# Altium schematic sheet PCIe.SchDoc
size A4; SheetNumber: 3; SheetTotal: 15
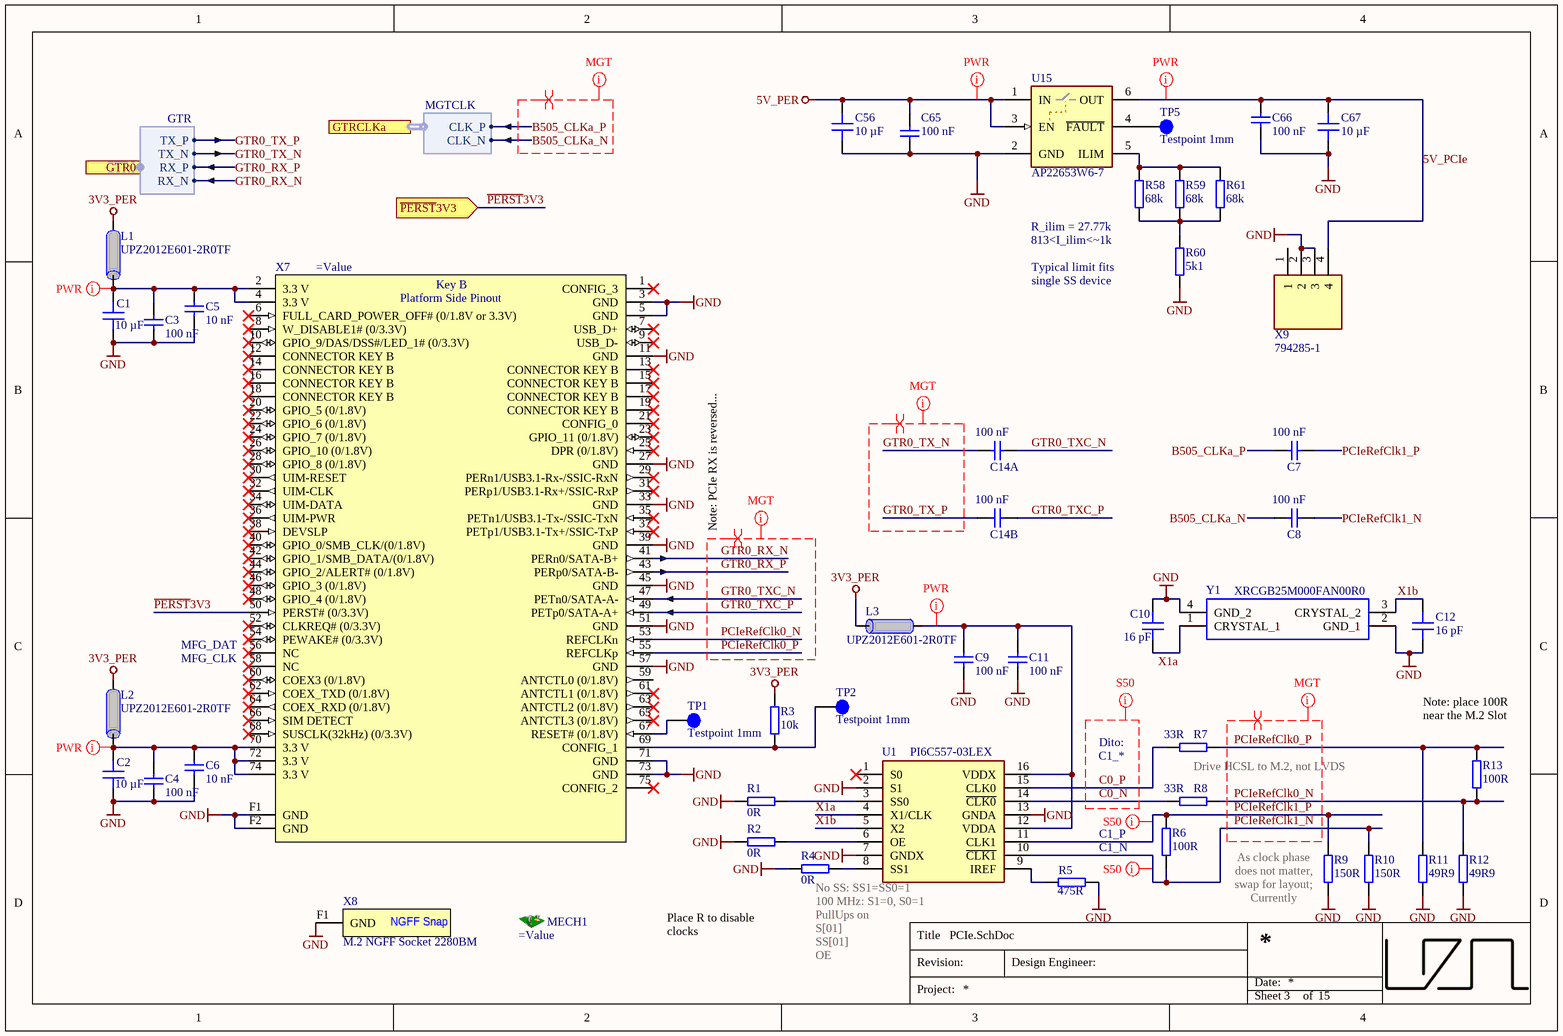
[diagram p0: PCIe.SchDoc]

## Parts
C1  10 µF  [C_0603_TE]
C2  10 µF  [C_0603_TE]
C3  100 nF  [C_0603_TE]
C4  100 nF  [C_0603_TE]
C5  10 nF  [C_0603_TE]
C6  10 nF  [C_0603_TE]
C7  100 nF  [C_0402_TE]
C8  100 nF  [C_0402_TE]
C9  100 nF  [C_0603_TE]
C10  16 pF  [C_0603_TE]
C11  100 nF  [C_0603_TE]
C12  16 pF  [C_0603_TE]
C14A  100 nF  [C_0402_TE]
C14B  100 nF  [C_0402_TE]
C56  10 µF  [C_0603_TE]
C65  100 nF  [C_0603_TE]
C66  100 nF  [C_0603_TE]
C67  10 µF  [C_0603_TE]
L1  UPZ2012E601-2R0TF  [INDC2012X92N_V]
L2  UPZ2012E601-2R0TF  [INDC2012X92N_V]
L3  UPZ2012E601-2R0TF  [INDC2012X92N_V]
MECH1  (no value)  [WA-SMSI-2.5mm]
R1  0R  [R_0603_TE]
R2  0R  [R_0603_TE]
R3  10k  [R_0603_TE]
R4  0R  [R_0603_TE]
R5  475R  [RES 0603_1608]
R6  100R  [R_0603_TE]
R7  33R  [R_0603_TE]
R8  33R  [R_0603_TE]
R9  150R  [R_0603_TE]
R10  150R  [R_0603_TE]
R11  49R9  [RES 0603_1608]
R12  49R9  [RES 0603_1608]
R13  100R  [R_0603_TE]
R58  68k  [R_0603_TE]
R59  68k  [R_0603_TE]
R60  5k1  [R_0603_TE]
R61  68k  [R_0603_TE]
TP1  Testpoint 1mm  [TP_1mm]  (no BOM)
TP2  Testpoint 1mm  [TP_1mm]  (no BOM)
TP5  Testpoint 1mm  [TP_1mm]  (no BOM)
U1  PI6C557-03LEX  [SOP65P640X120-16N]
U15  AP22653W6-7  [TSOT26-6]
X7  (no value)  [2199230-3]
X8  M.2 NGFF Socket 2280BM  [M.2-NGFF-Socket-2280BM]  (no BOM)
X9  794285-1  [7942851]
Y1  XRCGB25M000FAN00R0  [XRCGB25M000FAN00R0]

## Ports
GTR0 (harness GTR), GTRCLKa (harness MGTCLK), ~{PERST}3V3 (in)

## Harnesses
GTR: RX_N, RX_P, TX_N, TX_P
MGTCLK: CLK_N, CLK_P

## Nets
3V3_PER: L1.1 L2.1 L3.2 R3.2
5V_PER: C56.2 C65.1 U15.1(IN) U15.3(EN)
GND: C1.1 C2.1 C3.1 C4.1 C5.1 C6.1 C9.1 C10.1 C11.1 C12.2 C56.1 C65.2 C66.2 C67.1 R1.1 R2.1 R4.1 R5.1 R9.1 R10.1 R11.1 R12.1 R60.1 U1.2(S1) U1.7(GNDX) U1.13(GNDA) U15.2(GND) X7.3(GND) X7.5(GND) X7.11(GND) X7.27(GND) X7.33(GND) X7.39(GND) X7.45(GND) X7.51(GND) X7.57(GND) X7.71(GND) X7.73(GND) X7.F1(GND) X7.F2(GND) X8.F1(GND) X9.2 X9.3 Y1.2(GND_1) Y1.4(GND_2)
5V_PCIe: C66.1 C67.2 U15.6(OUT) X9.4
B505_CLKa_N: C8.1 ; port GTRCLKa.CLK_N
B505_CLKa_P: C7.1 ; port GTRCLKa.CLK_P
C0_N: R8.1 U1.14(~{CLK0})
C0_P: R7.1 U1.15(CLK0)
GTR0_RX_N: X7.41(PERn0/SATA-B+) ; port GTR0.RX_N
GTR0_RX_P: X7.43(PERp0/SATA-B-) ; port GTR0.RX_P
GTR0_TX_N: C14A.1 ; port GTR0.TX_N
GTR0_TX_P: C14B.1 ; port GTR0.TX_P
GTR0_TXC_N: C14A.2 X7.47(PETn0/SATA-A-)
GTR0_TXC_P: C14B.2 X7.49(PETp0/SATA-A+)
~{PERST}3V3: X7.50(PERST#_(0/3.3V)) ; port ~{PERST}3V3
PCIeRefClk0_N: R8.2 R12.2 R13.1 X7.53(REFCLKn)
PCIeRefClk0_P: R7.2 R11.2 R13.2 X7.55(REFCLKp)
PCIeRefClk1_N: C8.2 R6.1 R10.2 U1.10(~{CLK1})
PCIeRefClk1_P: C7.2 R6.2 R9.2 U1.11(CLK1)
X1a: C10.2 U1.4(X1/CLK) Y1.1(CRYSTAL_1)
X1b: C12.1 U1.5(X2) Y1.3(CRYSTAL_2)
NetC1_2: C1.2 C3.2 C5.2 L1.2 X7.2(3.3_V) X7.4(3.3_V)
NetC2_2: C2.2 C4.2 C6.2 L2.2 X7.70(3.3_V) X7.72(3.3_V) X7.74(3.3_V)
NetC9_2: C9.2 C11.2 L3.1 U1.12(VDDA) U1.16(VDDX)
NetR1_2: R1.2 U1.3(SS0)
NetR2_2: R2.2 U1.6(OE)
NetR3_1: R3.1 TP2.1 X7.69(CONFIG_1)
NetR4_2: R4.2 U1.8(SS1)
NetR5_2: R5.2 U1.9(IREF)
NetR58_1: R58.1 R59.1 R60.2 R61.1
NetR58_2: R58.2 R59.2 R61.2 U15.5(ILIM)
NetTP1_1: TP1.1 X7.67(RESET#_(0/1.8V))
NetTP5_1: TP5.1 U15.4(~{FAULT})

Not connected (* = marked no-connect by the designer): U1 1(S0)*; X7 1(CONFIG_3)* 6(FULL_CARD_POWER_OFF#_(0/1.8V_or_3.3V))* 7(USB_D+)* 8(W_DISABLE1#_(0/3.3V))* 9(USB_D-)* 10(GPIO_9/DAS/DSS#/LED_1#_(0/3.3V))* 12(CONNECTOR_KEY_B)* 13(CONNECTOR_KEY_B)* 14(CONNECTOR_KEY_B)* 15(CONNECTOR_KEY_B)* 16(CONNECTOR_KEY_B)* 17(CONNECTOR_KEY_B)* 18(CONNECTOR_KEY_B)* 19(CONNECTOR_KEY_B)* 20(GPIO_5_(0/1.8V))* 21(CONFIG_0)* 22(GPIO_6_(0/1.8V))* 23(GPIO_11_(0/1.8V))* 24(GPIO_7_(0/1.8V))* 25(DPR_(0/1.8V))* 26(GPIO_10_(0/1.8V))* 28(GPIO_8_(0/1.8V))* 29(PERn1/USB3.1-Rx-/SSIC-RxN)* 30(UIM-RESET)* 31(PERp1/USB3.1-Rx+/SSIC-RxP)* 32(UIM-CLK)* 34(UIM-DATA)* 35(PETn1/USB3.1-Tx-/SSIC-TxN)* 36(UIM-PWR)* 37(PETp1/USB3.1-Tx+/SSIC-TxP)* 38(DEVSLP)* 40(GPIO_0/SMB_CLK/(0/1.8V))* 42(GPIO_1/SMB_DATA/(0/1.8V))* 44(GPIO_2/ALERT#_(0/1.8V))* 46(GPIO_3_(0/1.8V))* 48(GPIO_4_(0/1.8V))* 52(CLKREQ#_(0/3.3V))* 54(PEWAKE#_(0/3.3V))* 56(NC)* 58(NC)* 59(ANTCTL0_(0/1.8V)) 60(COEX3_(0/1.8V))* 61(ANTCTL1_(0/1.8V))* 62(COEX_TXD_(0/1.8V))* 63(ANTCTL2_(0/1.8V))* 64(COEX_RXD_(0/1.8V))* 65(ANTCTL3_(0/1.8V))* 66(SIM_DETECT)* 68(SUSCLK(32kHz)_(0/3.3V))* 75(CONFIG_2)*; X9 1

## Layout directives
differential pair: B505_CLKa_N, B505_CLKa_P, GTR0_RX_N, GTR0_RX_P, GTR0_TX_N, GTR0_TX_P, GTR0_TXC_N, GTR0_TXC_P, PCIeRefClk0_N, PCIeRefClk0_P, PCIeRefClk1_N, PCIeRefClk1_P
net class MGT: B505_CLKa_N, B505_CLKa_P, GTR0_RX_N, GTR0_RX_P, GTR0_TX_N, GTR0_TX_P, GTR0_TXC_N, GTR0_TXC_P, PCIeRefClk0_N, PCIeRefClk0_P, PCIeRefClk1_N, PCIeRefClk1_P
net class S50: C0_N, C0_P, PCIeRefClk1_N, PCIeRefClk1_P
net class PWR: 5V_PCIe, 5V_PER, NetC1_2, NetC2_2, NetC9_2

## Notes on the sheet
- (near R58) R_ilim = 27.77k
- (near R58) 813<I_ilim<~1k
- Typical limit fits
- single SS device
- Note: PCIe RX is reversed...
- MFG_DAT
- MFG_CLK
- Dito: C1_*
- (near R7) Drive HCSL to M.2, not LVDS
- (near R13) Note: place 100R near the M.2 Slot
- C1_P
- C1_N
- 100 MHz: S1=0, S0=1
- No SS: SS1=SS0=1
- PullUps on
- (near R9) As clock phase does not matter, swap for layout; Currently 1-on-1
- Place R to disable clocks
- S[01]
- SS[01]
- OE
- Title
- Revision:
- Design Engineer:
- Date:
- Project:
- Sheet
- of
- (in symbol 1-2199230-5) Key B; Platform Side Pinout
- (in symbol M.2 NGFF Socket 2280BM) NGFF Snap

## Library data of the parts
C1 C2 C56 C67 = CL10A106MO8NQNC: Capacitor 0603, 16 VDC, 10 µF, X5R; Manufacturer: Samsung Electro-Mechanics; Tolerance: 20 %; Voltage Rating: 16 VDC; Created from: AGeiger; Manufacturer Part Number: CL10A106MO8NQNC; PartID: 101; Created On: 22/08/2022 13:56:44; ComponentLink1Description: Datasheet; ComponentLink1URL: https://datasheet.lcsc.com/lcsc/1810261909_Samsung-Electro-Mechanics-CL10A106MO8NQNC_C92487.pdf; Component Type: Capacitor 0603; Device Package: 0603; Last Updated: 19/11/2024 12:40:46; Mounting Type: SMD; Operating Temperature: -55 - 85°C; Supplier 1: LCSC; Supplier Part Number 1: C92487; Type: Capacitor; Value: 10 µF; Live Cycle Status: 1; LCSC Part Number: C92487; Series: X5R
C3 C4 C9 C11 C65 C66 = UZgen_C_0603_100nF_50V_X7R: Generic capacitor; Manufacturer: UZgen; Voltage: 50V; Tolerance: 10 %; Created from: AGeiger; Manufacturer Part Number: UZgen_C_0603_100nF_50V_X7R; PartID: 1; Created On: 02/07/2024 14:42:23; Value: 100 nF; Device Package: 0603; Technology: X7R; Mounting Type: SMD; Last Updated: 08/08/2024 15:01:15
C5 C6 = UZgen_C_0603_10nF_50V_X7R: Generic capacitor; Manufacturer: UZgen; Tolerance: 10 %; Created from: UZgenTool; Voltage: 50V; Manufacturer Part Number: UZgen_C_0603_10nF_50V_X7R; PartID: 4263; Created On: 02/08/2024 11:18:09; Device Package: 0603; Last Updated: 02/08/2024 11:18:09; Mounting Type: SMD; Value: 10 nF; Technology: X7R
C7 C8 C14A C14B = UZgen_C_0402_100nF_50V_X7R: Generic capacitor; Manufacturer: UZgen; Voltage: 50V; Tolerance: 10 %; Created from: UZgenTool; Manufacturer Part Number: UZgen_C_0402_100nF_50V_X7R; PartID: 3431; Created On: 02/08/2024 11:17:51; Value: 100 nF; Device Package: 0402; Technology: X7R; Mounting Type: SMD; Last Updated: 02/08/2024 11:17:51
C10 C12 = 0603CG160J500NT: 50V 16pF C0G ±5% 0603 Multilayer Ceramic Capacitors MLCC - SMD/SMT ROHS; Manufacturer: FH; Voltage Rating: 50 VDC; Created from: AGeiger; Tolerance: 5%; Value: 16 pF; Manufacturer Part Number: 0603CG160J500NT; PartID: 123; Created On: 06/06/2023 09:37:57; ComponentLink1Description: Datasheet; ComponentLink1URL: https://datasheet.lcsc.com/lcsc/2304140030_FH--Guangdong-Fenghua-Advanced-Tech-0603CG160J500NT_C1646.pdf; Component Type: Capacitor 0603; Device Package: 0603; Last Updated: 22/04/2025 15:38:45; Mounting Type: SMD; Operating Temperature: -55 to +125°C; Series: C0G; Supplier 1: LCSC; Supplier Part Number 1: C1646; Type: Capacitor; Live Cycle Status: 1; LCSC Part Number: C1646
L1-L3 = UPZ2012E601-2R0TF: 2A 1 90mΩ 600Ω@100MHz ±25% 0805  Ferrite Beads ROHS; Manufacturer: Sunlord; Value: 90 Ohm; Created from: AGeiger; Manufacturer Part Number: UPZ2012E601-2R0TF; PartID: 11; Created On: 03.09.2022 16:57:01; ComponentLink1Description: Datasheet; ComponentLink1URL: https://datasheet.lcsc.com/lcsc/2110091730_Sunlord-UPZ2012E601-2R0TF_C98308.pdf; Component Type: Ferrite Beads; Device Package: 0805; Last Updated: 03.09.2022 17:01:04; Mounting Type: SMD; Operating Temperature: -55 - 125 °C; Supplier 1: LCSC; Supplier Part Number 1: C98308; Type: Ferrite Bead; DC current: 2 A; Live Cycle Status: 1; LCSC Part Number: C98308
MECH1 = SMTSOM325BTR: SMD Nut; Manufacturer: YIYUAN; AN: 32101; Mixed: THT; H-ART: 9774025360; Temperature-Range: -55/+150 (Abs); Extra: WA-SMSI; Created from: AGeiger; HelpURL: B:\AD\adlib\datasheet\WE_9774025360; LCSC Part #: C5301784; Manufacturer Part Number: SMTSOM325BTR; PartID: 13; Created On: 06.06.2023 08:57:00; ComponentLink1Description: Datasheet; ComponentLink1URL: https://datasheet.lcsc.com/lcsc/2302021209_YIYUAN-SMTSOM325BTR_C5301784.pdf; Last Updated: 06.06.2023 08:57:00; Mounting Type: SMD; Series: M2; Supplier 1: LCSC; Supplier Part Number 1: C5301784; Value: SMTSOM325BTR; LCSC Part Number: C5301784
R1 R2 R4 = UZgen_R_0603_0R: Generic resistor; Manufacturer: UZgen; Tolerance: 1 %; Created from: UZgenTool; Manufacturer Part Number: UZgen_R_0603_0R; PartID: 581; Created On: 08/07/2024 14:34:30; Device Package: 0603; Last Updated: 08/07/2024 14:34:30; Mounting Type: SMD; Value: 0R
R3 = UZgen_R_0603_10k: Generic resistor; Manufacturer: UZgen; Tolerance: 1 %; Created from: AGeiger; Manufacturer Part Number: UZgen_R_0603_10k; PartID: 1; Created On: 02/07/2024 14:34:53; Value: 10k; Device Package: 0603; Mounting Type: SMD; Last Updated: 02/07/2024 14:37:16
R5 = RC0603FR-07475RL: 100mW Thick Film Resistors 75V ±100ppm/℃ ±1% 475Ω 0603 Chip Resistor - Surface Mount ROHS; Manufacturer: YAGEO; Created from: AGeiger; Value: 475R; Tolerance: 1%; Manufacturer Part Number: RC0603FR-07475RL; PartID: 322; Created On: 07.02.2024 21:53:03; ComponentLink1Description: Datasheet; ComponentLink1URL: https://datasheet.lcsc.com/lcsc/2304140030_YAGEO-RC0603FR-07475RL_C137716.pdf; Component Type: SMD resistor; Device Package: 0603; Last Updated: 07.02.2024 21:53:03; Mounting Type: SMD; Supplier 1: LCSC; Supplier Part Number 1: C137716; Type: Resistor; Live Cycle Status: 1; LCSC Part Number: C137716
R6 R13 = UZgen_R_0603_100R: Generic resistor; Manufacturer: UZgen; Tolerance: 1 %; Created from: UZgenTool; Manufacturer Part Number: UZgen_R_0603_100R; PartID: 197; Created On: 02/07/2024 17:29:48; Value: 100R; Device Package: 0603; Mounting Type: SMD; Last Updated: 02/07/2024 17:29:48
R7 R8 = UZgen_R_0603_33R: Generic resistor; Manufacturer: UZgen; Tolerance: 1 %; Created from: UZgenTool; Manufacturer Part Number: UZgen_R_0603_33R; PartID: 185; Created On: 02/07/2024 17:29:48; Value: 33R; Device Package: 0603; Mounting Type: SMD; Last Updated: 02/07/2024 17:29:48
R9 R10 = UZgen_R_0603_150R: Generic resistor; Manufacturer: UZgen; Tolerance: 1 %; Created from: UZgenTool; Manufacturer Part Number: UZgen_R_0603_150R; PartID: 201; Created On: 02/07/2024 17:29:49; Value: 150R; Device Package: 0603; Mounting Type: SMD; Last Updated: 02/07/2024 17:29:49
R11 R12 = RC0603FR-0749R9L: 100mW Thick Film Resistors ±100ppm/℃ ±1% 49.9Ω 0603 Chip Resistor - Surface Mount ROHS; Manufacturer: YAGEO; Created from: AGeiger; Manufacturer Part Number: RC0603FR-0749R9L; PartID: 277; Created On: 14.06.2023 17:42:26; ComponentLink1Description: Datasheet; ComponentLink1URL: https://datasheet.lcsc.com/lcsc/2304140030_YAGEO-RC0603FR-0749R9L_C114625.pdf; Component Type: SMD resistor; Device Package: 0603; Last Updated: 14.06.2023 17:42:26; Mounting Type: SMD; Supplier 1: LCSC; Supplier Part Number 1: C114625; Type: Resistor; Tolerance: 1%; Value: 49R9; Live Cycle Status: 1; LCSC Part Number: C114625
R58 R59 R61 = UZgen_R_0603_68k: Generic resistor; Manufacturer: UZgen; Tolerance: 1 %; Created from: UZgenTool; Manufacturer Part Number: UZgen_R_0603_68k; PartID: 264; Created On: 02/07/2024 17:29:50; Value: 68k; Device Package: 0603; Mounting Type: SMD; Last Updated: 02/07/2024 17:29:50
R60 = UZgen_R_0603_5k1: Generic resistor; Manufacturer: UZgen; Tolerance: 1 %; Created from: UZgenTool; Manufacturer Part Number: UZgen_R_0603_5k1; PartID: 238; Created On: 02/07/2024 17:29:50; Value: 5k1; Device Package: 0603; Mounting Type: SMD; Last Updated: 02/07/2024 17:29:50
TP1 TP2 TP5 = NULL: Manufacturer Part Number: NULL; Created from: AGeiger; Created: 2018_06_25_AGeiger; Value: Testpoint 1mm; PartID: 9; Created On: 20/09/2022 13:14:57; Component Type: Testpoint; Last Updated: 20/09/2022 13:15:39; Manufacturer: NULL; Supplier 1: NULL; Supplier Part Number 1: NULL; Type: Testpoint; Live Cycle Status: 1
U1 = PI6C557-03LEX: 200MHz 2 TSSOP-16 Clock Generators / Frequency Synthesizers / PLL ROHS; Manufacturer: Diodes Inc.; Created from: AGeiger; Manufacturer Part Number: PI6C557-03LEX; PartID: 30; Created On: 06.06.2023 09:23:24; ComponentLink1Description: Datasheet; ComponentLink1URL: https://datasheet.lcsc.com/lcsc/2210281030_Diodes-Incorporated-PI6C557-03LEX_C500785.pdf; Component Type: Clock Generator; Device Package: SMD; Last Updated: 06.06.2023 09:23:24; Mounting Type: SMD; Operating Temperature: -40 to +85 °C; Supplier 1: LCSC; Supplier Part Number 1: C500785; Type: Clock Generator; Value: PI6C557-03LEX; Live Cycle Status: 1; LCSC Part Number: C500785
U15 = AP22653W6-7: Precision Adjustable Current-limited Power Switch; Manufacturer: Diodes Incorporated; Created from: MGeier; Manufacturer Part Number: AP22653W6-7; PartID: 10; Created On: 10/04/2025 19:40:00; ComponentLink1Description: Datasheet; ComponentLink1URL: https://www.diodes.com/datasheet/download/AP22652_AP22653_AP22652A_AP22653A.pdf; ComponentLink2Description: Homepage; ComponentLink2URL: https://www.diodes.com/part/view/AP22653; Component Type: Power Switch ICs; Device Package: SOT26; Last Updated: 11/04/2025 15:13:45; Mounting Type: SMD; Operating Temperature: -40 to +125 °C; Series: AP22652/AP22653/AP22652A/AP22653A; Supplier 1: LCSC; Supplier Part Number 1: C2158037; Value: AP22653W6-7; LCSC Part Number: C2158037
X7 = 1-2199230-5: M.2 0.5mm Surface Mount 67 SMD,P=0.5mm Card Edge Connectors ROHS; Manufacturer: TE Connectivity; AN: 31952; Mixed: SMT; Temperature-Range: -40/+80; Extra: Socket 67pol. 4.2mm; Created from: AGeiger; Case: M.2 B; HelpURL: B:\AD\adlib\datasheet\TE\2199230-3; H-ART: 2199230-3; LCSC Part #: C590854; Manufacturer Part Number: 1-2199230-5; PartID: 12; Created On: 06.06.2023 08:54:40; ComponentLink1Description: Datasheet; ComponentLink1URL: https://datasheet.lcsc.com/lcsc/2008241633_TE-Connectivity-1-2199230-5_C590854.pdf; Last Updated: 06.06.2023 08:54:40; Mounting Type: SMD; Operating Temperature: -40 °C to +80 °C; Series: M2; Supplier 1: LCSC; Supplier Part Number 1: C590854; Value: 1-2199230-5; LCSC Part Number: C590854
X8 = M.2 NGFF Socket 2280BM: M.2 NGFF Socket 2280BM Snap; Manufacturer: n.a.; AN: 26274; Mixed: SMT; Extra: Variant of 25485; Created from: AGeiger; HelpURL: B:\AD\adlib\datasheet\1-2199119-0; Manufacturer Part Number: M.2 NGFF Socket 2280BM; PartID: 15; Created On: 06.06.2023 09:01:36; ComponentLink1Description: Datasheet; ComponentLink1URL: https://datasheet.lcsc.com/lcsc/2302021209_YIYUAN-SMTSOM325BTR_C5301784.pdf; Last Updated: 06.06.2023 09:04:37; Series: M2; Supplier 1: n.a.; Supplier Part Number 1: n.a.; Value: M.2 NGFF Socket 2280BM
X9 = 794285-1: 1 5.08mm Tin Phosphor Bronze Direct Insert Plugin,P=5.08mm Wire To Board Connector ROHS; Manufacturer: TE; Manufacturer_Name: TE Connectivity; Created from: FRosner; Number of positions: 4; Manufacturer Part Number: 794285-1; PartID: 60; Created On: 29/04/2025 15:19:02; ComponentLink1Description: Datasheet; ComponentLink1URL: https://jlcpcb.com/api/file/downloadByFileSystemAccessId/8590260072275750912; Last Updated: 29/04/2025 15:19:02; Mounting Type: THT; Operating Temperature: -55 - +105 °C; Supplier 1: Mouser; Supplier Part Number 1: 571-794285-1; LCSC Part Number: C3743067; Datasheet Link: https://www.te.com/commerce/DocumentDelivery/DDEController?Action=srchrtrv&DocNm=82181_SOFTSHELL_STANDARD_DENSITY&DocType=Catalog%20Section&DocLang=English&PartCntxt=794285-1&DocFormat=pdf; Height: 11.56mm; Manufacturer_Part_Number: 794285-1; Mouser Part Number: 571-794285-1; Mouser Price/Stock: https://www.mouser.co.uk/ProductDetail/TE-Connectivity-AMP/794285-1?qs=9XeCyKUmamjtqPG5jJ4Npw%3D%3D; Arrow Part Number: 794285-1; Arrow Price/Stock: https://www.arrow.com/en/products/794285-1/te-connectivity?region=nac; Component Type: TE Connector; Device Package: Connector; Supplier 2: LCSC; Supplier Part Number 2: C3743067; Type: Connector; Live Cycle Status: 1; Number of rows: 1; Stock number: not stored
Y1 = XRCGB25M000FAN00R0: 25MHz 6pF ±25ppm SMD2016-4P Crystals ROHS; Manufacturer: Murata; Created from: AGeiger; Manufacturer Part Number: XRCGB25M000FAN00R0; PartID: 29; Created On: 06.06.2023 07:42:20; ComponentLink1Description: Datasheet; ComponentLink1URL: https://datasheet.lcsc.com/lcsc/2201200600_Murata-Electronics-XRCGB25M000FAN00R0_C1669725.pdf; Component Type: Crystal; Device Package: SMD; Last Updated: 16.06.2023 08:37:47; Mounting Type: SMD; Operating Temperature: -40 to +85 °C; Supplier 1: LCSC; Supplier Part Number 1: C1669725; Type: Crystal; Value: XRCGB25M000FAN00R0; Live Cycle Status: 1; LCSC Part Number: C1669725